# EAGLE design Sensor-Breakout-Module (EAGLE 5.12)
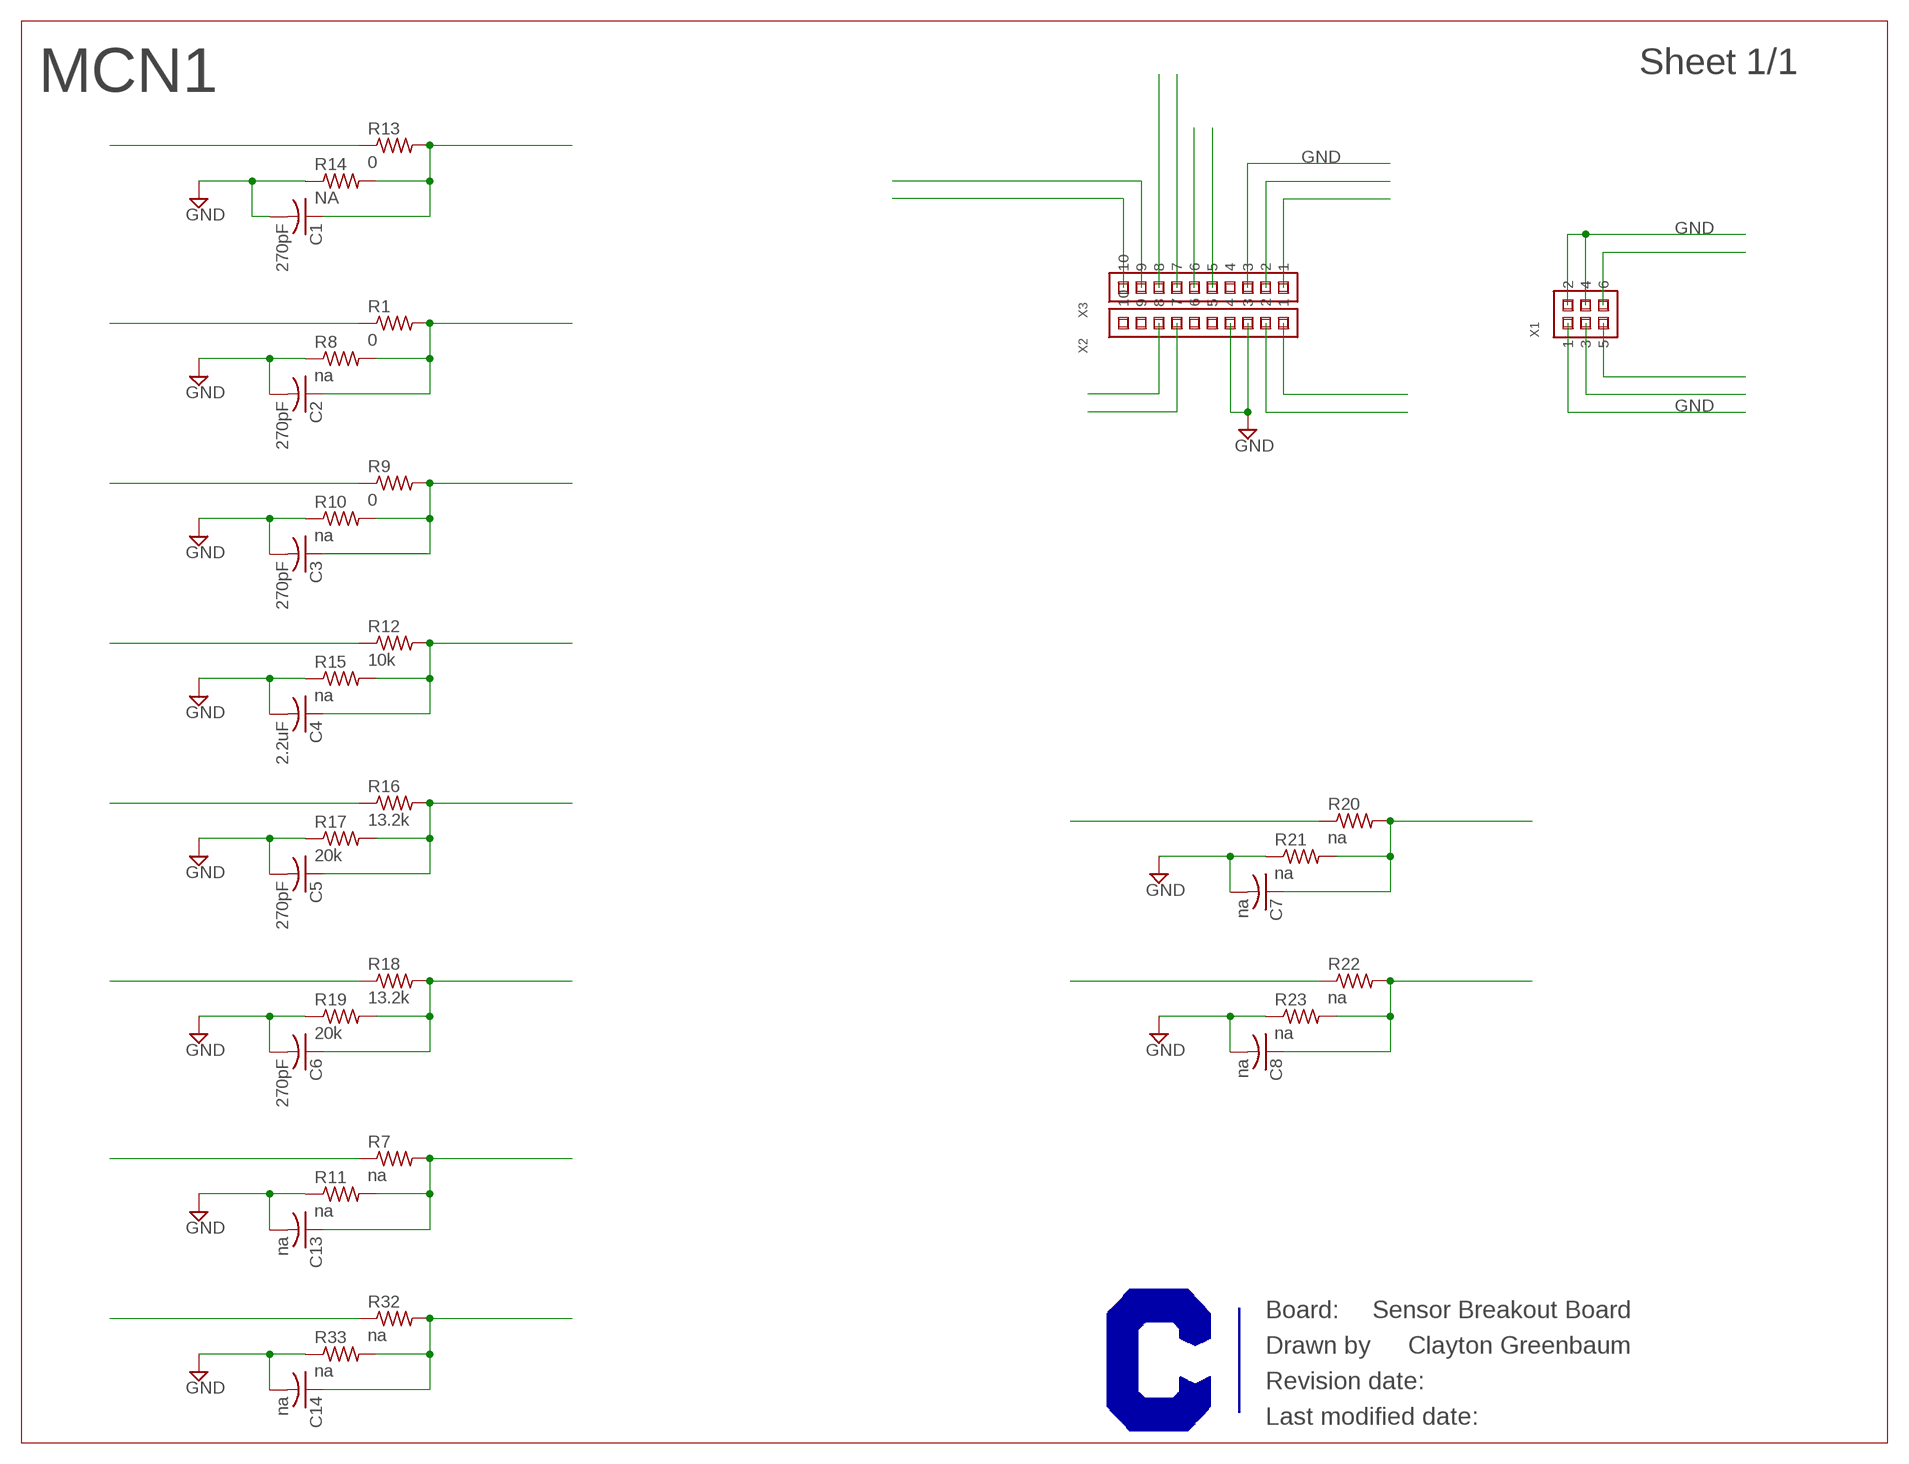
[diagram p0: schematic, sheet 1]

## Parts
C1  270pF  C-USC0603  [C0603]
C2  270pF  C-USC0603  [C0603]
C3  270pF  C-USC0603  [C0603]
C4  2.2uF  C-USC0603  [C0603]
C5  270pF  C-USC0603  [C0603]
C6  270pF  C-USC0603  [C0603]
C7  na  C-USC0603  [C0603]
C8  na  C-USC0603  [C0603]
C13  na  C-USC0603  [C0603]
C14  na  C-USC0603  [C0603]
R1  0  R-US_R0603  [R0603]
R7  na  R-US_R0603  [R0603]
R8  na  R-US_R0603  [R0603]
R9  0  R-US_R0603  [R0603]
R10  na  R-US_R0603  [R0603]
R11  na  R-US_R0603  [R0603]
R12  10k  R-US_R0603  [R0603]
R13  0  R-US_R0603  [R0603]
R14  NA  R-US_R0603  [R0603]
R15  na  R-US_R0603  [R0603]
R16  13.2k  R-US_R0603  [R0603]
R17  20k  R-US_R0603  [R0603]
R18  13.2k  R-US_R0603  [R0603]
R19  20k  R-US_R0603  [R0603]
R20  na  R-US_R0603  [R0603]
R21  na  R-US_R0603  [R0603]
R22  na  R-US_R0603  [R0603]
R23  na  R-US_R0603  [R0603]
R32  na  R-US_R0603  [R0603]
R33  na  R-US_R0603  [R0603]
X1  M22-71403XX  [M22-71403XX]
X2  M22-71310XX  [M22-71310XX]
X3  M22-71310XX  [M22-71310XX]

## Nets
3V3_MCN1: R12.1 X3.8
5V_MCN1: X3.7
12V: X1.6
AIN7_MCN1: C13.1 R7.2 R11.2 X2.1
AIN8_MCN1: C14.1 R32.2 R33.2 X2.2
CANA_H: X1.5
CANA_L: X1.3
GND: C1.2 C2.2 C3.2 C4.2 C5.2 C6.2 C7.2 C8.2 C13.2 C14.2 R8.1 R10.1 R11.1 R14.1 R15.1 R17.1 R19.1 R21.1 R23.1 R33.1 X1.1 X1.2 X1.4 X2.3 X2.4 X3.3
GP0_MCN1: C7.1 R20.2 R21.2 X2.7
GP1_MCN1: C8.1 R22.2 R23.2 X2.8
PRES_AMB: R16.1
PRES_AMB_MCN1: C5.1 R16.2 R17.2 X3.2
PRES_MTR_IN: R18.1
PRES_MTR_IN_MCN1: C6.1 R18.2 R19.2 X3.1
STEER_ANG: R9.1
STEER_ANG_MCN1: C3.1 R9.2 R10.2 X3.6
SUSP_FRNT: R13.1
SUSP_FRNT_MCN1: C1.1 R13.2 R14.2 X3.10
SUSP_REAR: R1.1
SUSP_REAR_MCN1: C2.1 R1.2 R8.2 X3.9
TEMP_AMB_MCN1: C4.1 R12.2 R15.2 X3.5
UNUSED_A1: R7.1
UNUSED_A2: R32.1
UNUSED_GP1: R20.1
UNUSED_GP2: R22.1
Unconnected: X2.5 X2.6 X2.9 X2.10 X3.4

## Notes on the sheet
- MCN1
- Sensor Breakout Board
- Clayton Greenbaum

## Library data of the parts
C1-C8 C13 C14 = resistor:C-US: CAPACITOR, American symbol
R1 R7-R23 R32 R33 = rcl:R-US_: RESISTOR, American symbol
X1 = Harwin:M22-71403XX: M22-71403XX - 2x3 pos female header assy, 2.0mm pitch Datasheet: https://cdn.harwin.com/pdfs/M22-714.pdf; PARTNO: M22-7140342
X2 X3 = Harwin:M22-71310XX: Harwin M22-71310XX - 10pos single row female pin hdr, 2mm pitch Datasheet: https://cdn.harwin.com/pdfs/M22-713.pdf; PARTNO: M22-7131042

## Board
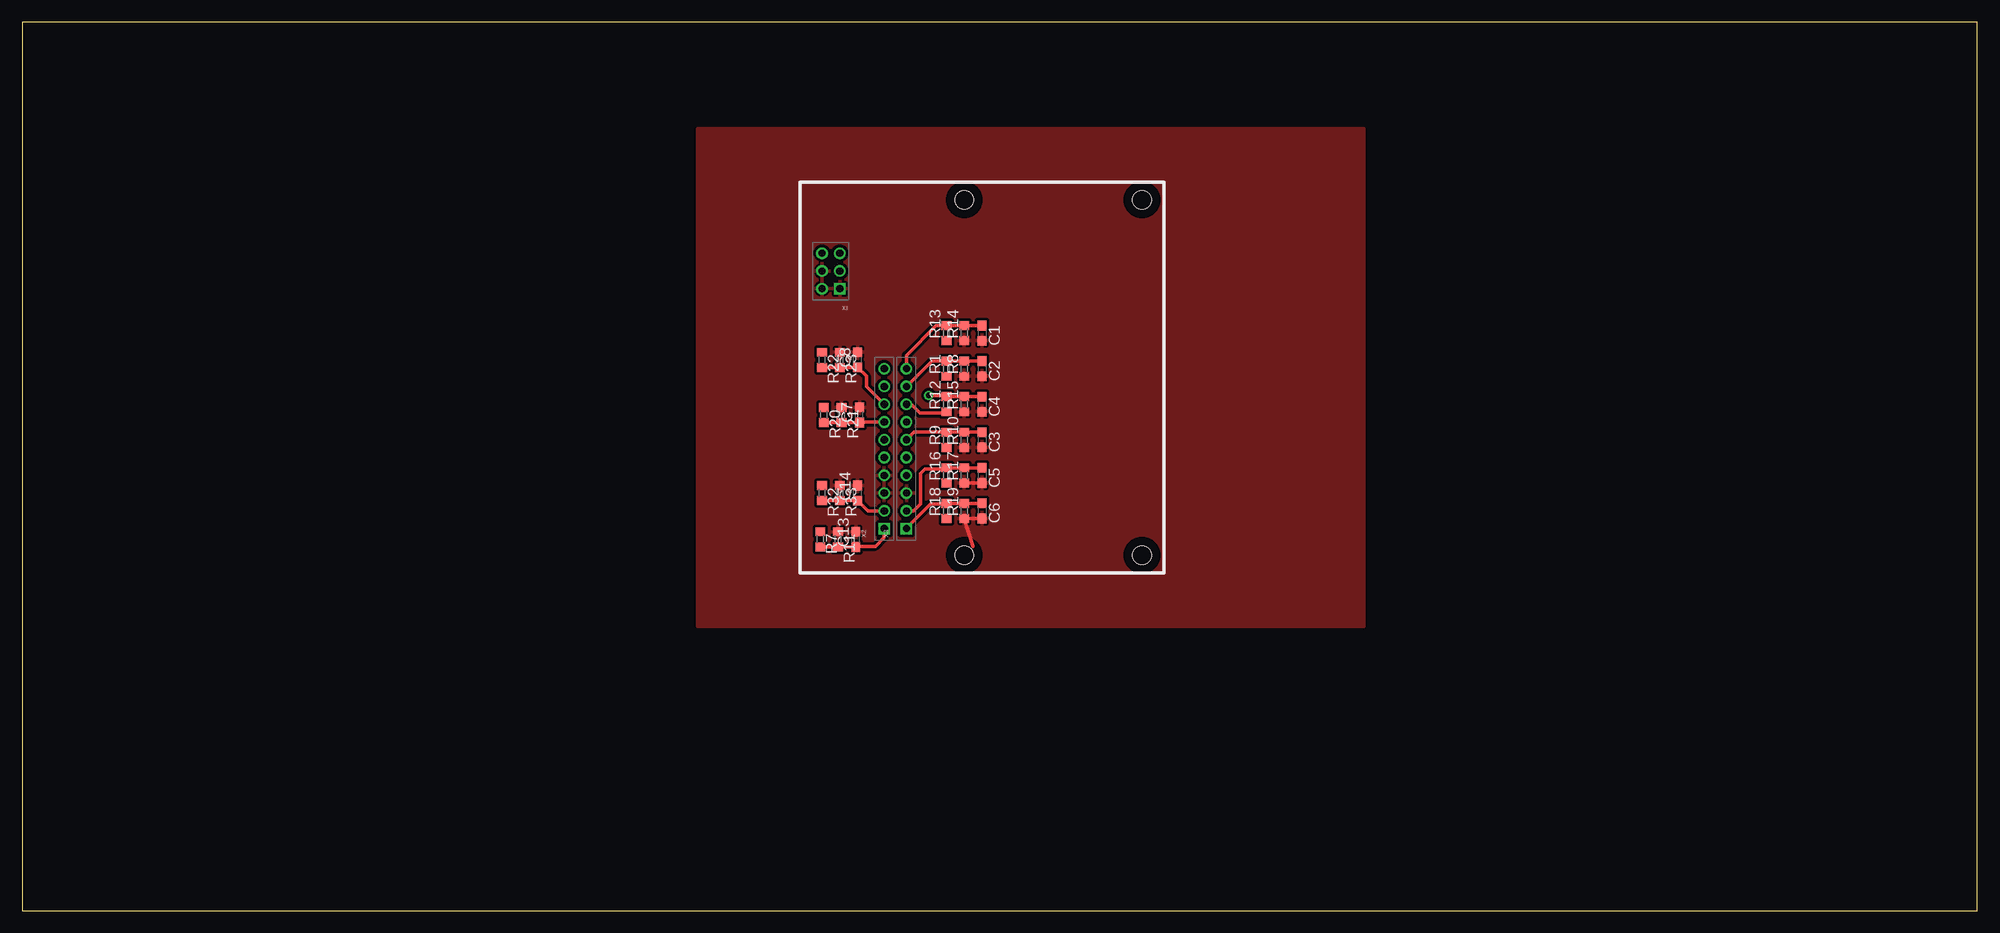
[diagram p1: board, top side]
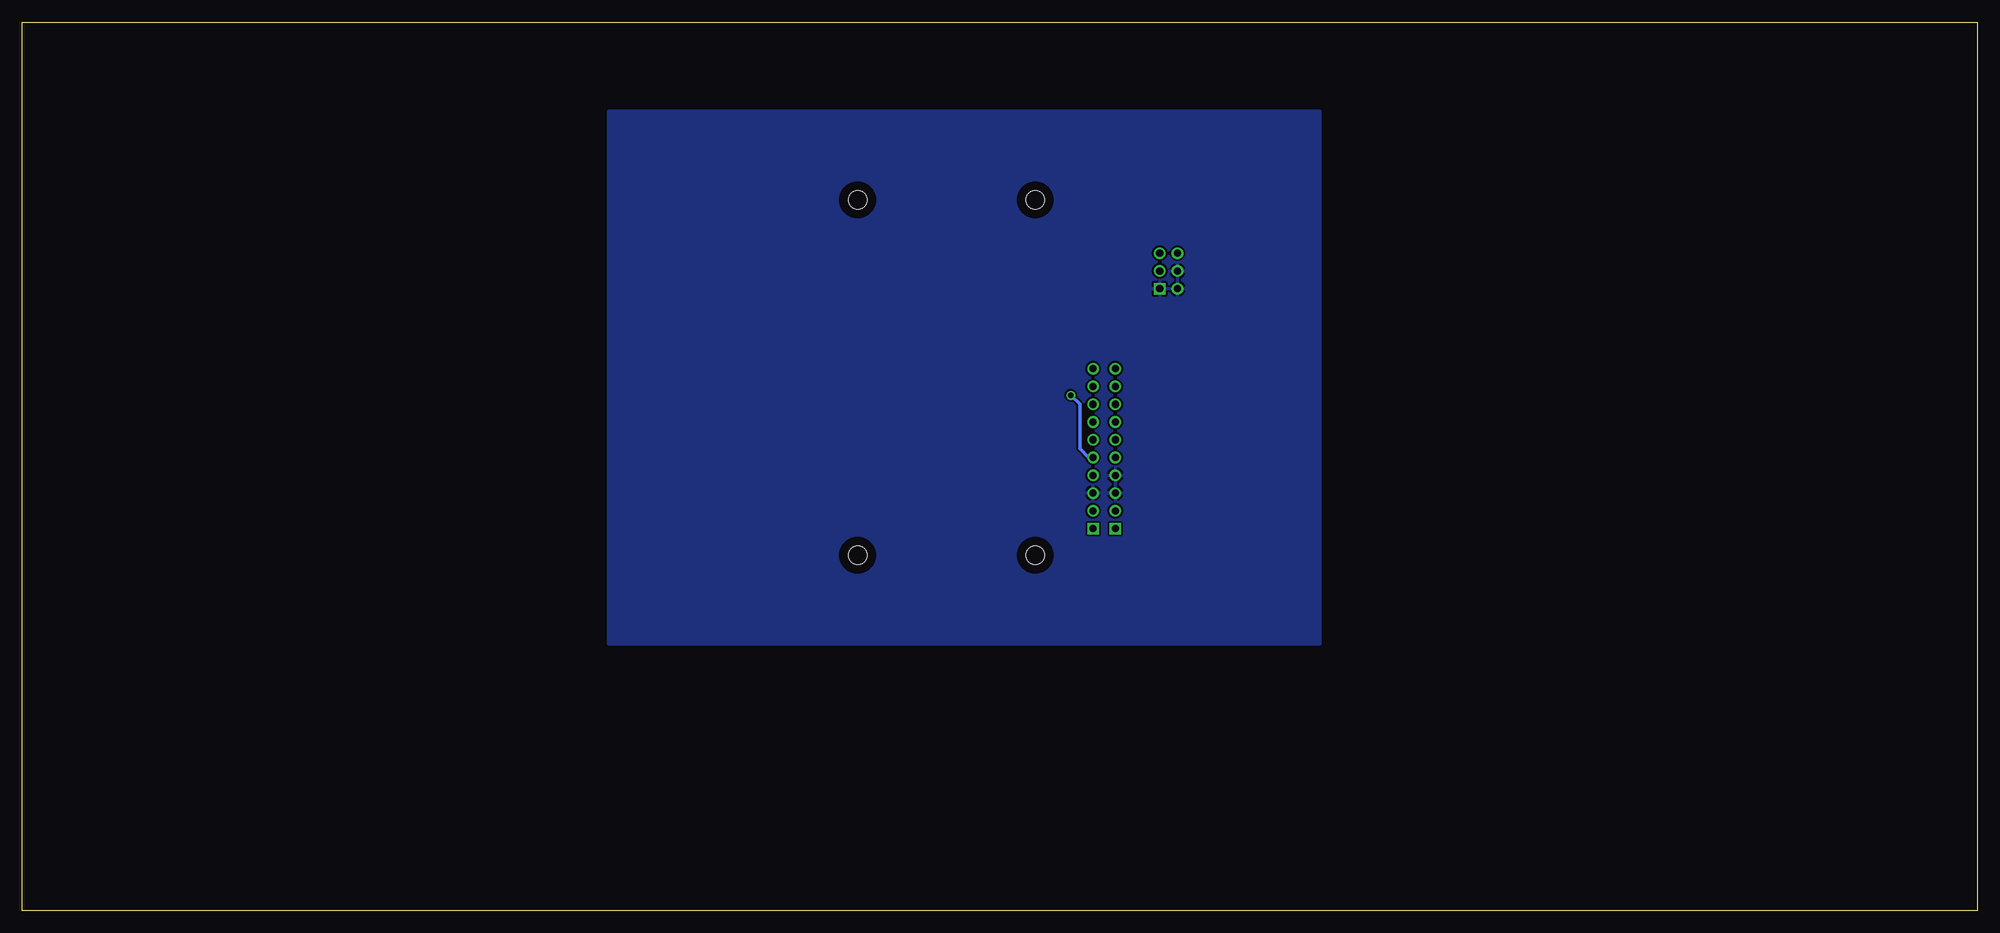
[diagram p2: board, bottom side, seen from below]

Size 220 x 100 mm. Coordinates in mm from the lower left corner, seen from the top.
Outline: 0,0 220,0 220,100 0,100 0,0
Copper layers (1*16): Top 0.035mm / dielectric 1.5mm / Bottom 0.035mm
Design rules "default": minimum track width 10mil, minimum drill 24mil, track to track 8mil, track to pad 8mil, pad to pad 8mil, via to via 8mil, smd to smd 8mil, copper to edge 40mil, drill to drill 8mil, minimum pad ring 10mil, minimum via ring 8mil, stop-mask expansion 4mil, vias tented up to drill 0mil, thermal gap 10mil
Holes 2.1 mm at 106,40 126,40 126,80 106,80

### Footprints (pad centres in the part's own frame; a part is rotated, then mirrored left to right if it is on the bottom)
C0603 = smd 1.1 x 1: 1 -0.85,0; 2 0.85,0
R0603 = smd 1 x 1.1: 1 -0.85,0; 2 0.85,0
M22-71403XX = drill 0.8 square: 1 -1,2 | drill 0.8 round: 2 1,2; 3 -1,0; 4 1,0; 5 -1,-2; 6 1,-2
M22-71310XX = drill 0.8 square: 1 0,-9 | drill 0.8 round: 2 0,-7; 3 0,-5; 4 0,-3; 5 0,-1; 6 0,1; 7 0,3; 8 0,5; 9 0,7; 10 0,9

### Placement (x,y rotation side)
C1  108,65 270 top
C2  108,61 270 top
C3  108,53 270 top
C4  108,57 270 top
C5  108,49 270 top
C6  108,45 270 top
C7  94.2,55.8 90 top
C8  94,62 90 top
C13  93.8,41.8 90 top
C14  94,47 90 top
R1  104,61 90 top
R7  89.8,41.8 270 top
R8  106,61 90 top
R9  104,53 90 top
R10  106,53 90 top
R11  91.8,41.8 270 top
R12  104,57 90 top
R13  104,65 90 top
R14  106,65 90 top
R15  106,57 90 top
R16  104,49 90 top
R17  106,49 90 top
R18  104,45 90 top
R19  106,45 90 top
R20  90.2,55.8 270 top
R21  92.2,55.8 270 top
R22  90,62 270 top
R23  92,62 270 top
R32  90,47 270 top
R33  92,47 270 top
X1  91,72 180 top
X2  97,52 0 top
X3  99.5,52 0 top

### Tracks (layer width: path | path; a pad name or v marks a point on that pad's centre or on a via)
3V3_MCN1
  Top 0.406: R12.1 103.85,56 101,56 100,57 X3.8
AIN7_MCN1
  Top 0.406: R7.2 R11.2 C13.1 93.85,41 96,41 97,42 X2.1
AIN8_MCN1
  Top 0.406: R32.2 R33.2 C14.1 95.15,45 X2.2
GND
  Top 0.406: C6.2 R19.1 107,41 | R17.1 C5.2
  pour Bottom: 74,30 154,30 154,32 154,90 74,90
  pour Top (isolate 0.305): 76,32 151,32 151,88 76,88
GP0_MCN1
  Top 0.406: R20.2 R21.2 C7.1 94.25,55 X2.7
GP1_MCN1
  Top 0.406: R22.2 R23.2 C8.1 95,60.15 95,59 X2.8
PRES_AMB_MCN1
  Top 0.406: C5.1 R17.2 R16.2 103.85,49.7 101.6,49.7 101.1,49.2 101.1,45.8 100.3,45 X3.2
PRES_MTR_IN_MCN1
  Top 0.406: C6.1 R19.2 R18.2 103.95,45.8 102.2,45.8 99.5,43.1 X3.1
STEER_ANG_MCN1
  Top 0.406: C3.1 R10.2 R9.2 100.35,53.85 X3.6
SUSP_FRNT_MCN1
  Top 0.406: C1.1 R14.2 R13.2 102.85,65.85 99.5,62.5 X3.10
SUSP_REAR_MCN1
  Top 0.406: C2.1 R8.2 R1.2 102.35,61.85 X3.9
TEMP_AMB_MCN1  (via drill 0.6)
  Top 0.406: C4.1 R15.2 R12.2 103.85,58 v102,58
  Bottom 0.406: v102,58 101,57 101,52 100,51 X3.5